# EAGLE design e18-board (EAGLE 9.6.2)
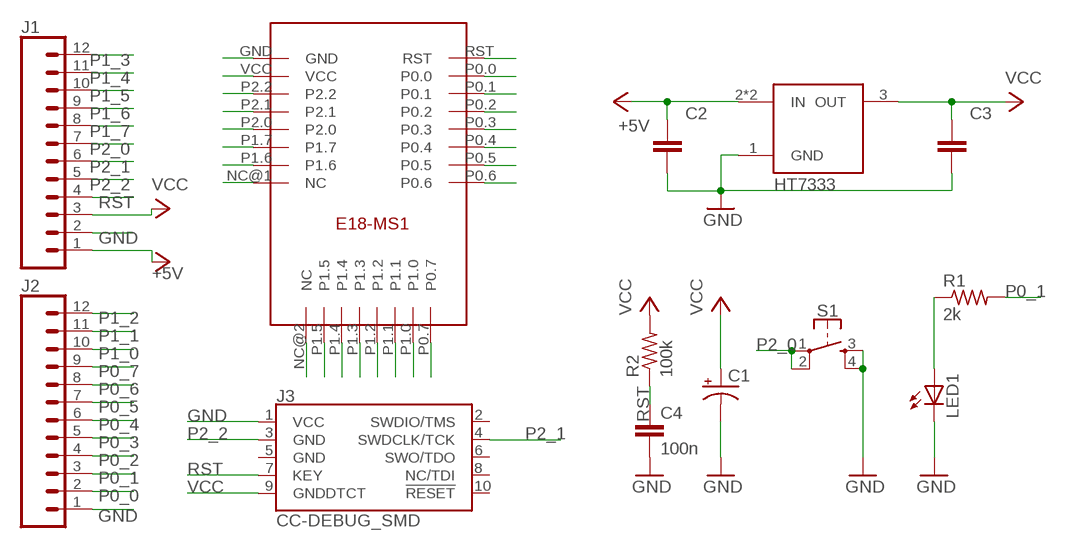
[diagram p0: schematic, sheet 1]

## Parts
C1  100uF  100UF-POLAR-EIA7343-10V-10%(TANT)  [EIA7343]
C2  C_TANTALUM-1411(3528-METRIC)  [CAPM3528X210]
C3  C_TANTALUM-1411(3528-METRIC)  [CAPM3528X210]
C4  100n  47NF-0603-25V-5%  [0603]
J1  CONN_12NO_SILK  [1X12_NO_SILK]
J2  CONN_12NO_SILK  [1X12_NO_SILK]
J3  CC-DEBUG_SMD  CORTEX_DEBUG_SMD  [SAMTECH_FTSH-105-01]
LED1  LEDCHIPLED_0805  [CHIPLED_0805]
R1  2k  R-US_R0603  [R0603]
R2  100k  R-US_R0603  [R0603]
S1  MOMENTARY-SWITCH-SPST-2-SMD-5.2MM  [TACTILE_SWITCH_SMD_5.2MM]
U$1  E18-MS1PCB  [E18-MS1-PCB]
U$2  HT7333  [SOT89]

## Nets
+5V: C2.1 J1.1 U$2.2(IN) U$2.2@1(IN)
GND: C1.C(-) C2.2 C3.2 C4.2 J1.2 J2.1 J3.1(VCC) LED1.C S1.3 S1.4 U$1.GND U$2.1(GND)
N$1: U$1.NC@2(NC)
N$2: LED1.A R1.1
N$8: U$1.NC@1(NC)
P0_0: J2.2 U$1.P0.0
P0_1: J2.3 R1.2 U$1.P0.1
P0_2: J2.4 U$1.P0.2
P0_3: J2.5 U$1.P0.3
P0_4: J2.6 U$1.P0.4
P0_5: J2.7 U$1.P0.5
P0_6: J2.8 U$1.P0.6
P0_7: J2.9 U$1.P0.7
P1_0: J2.10 U$1.P1.0
P1_1: J2.11 U$1.P1.1
P1_2: J2.12 U$1.P1.2
P1_3: J1.12 U$1.P1.3
P1_4: J1.11 U$1.P1.4
P1_5: J1.10 U$1.P1.5
P1_6: J1.9 U$1.P1.6
P1_7: J1.8 U$1.P1.7
P2_0: J1.7 S1.1 S1.2 U$1.P2.0
P2_1: J1.6 J3.4(SWDCLK/TCK) U$1.P2.1
P2_2: J1.5 J3.3(GND) U$1.P2.2
RST: C4.1 J1.4 J3.7(KEY) R2.1 U$1.RST
VCC: C1.A(+) C3.1 J1.3 J3.9(GNDDTCT) R2.2 U$1.VCC U$2.3(OUT)
Unconnected: J3.2(SWDIO/TMS) J3.5(GND) J3.6(SWO/TDO) J3.8(NC/TDI) J3.10(!RESET)

## Library data of the parts
C1 = SparkFun-Capacitors:100UF-POLAR: 100µF polarized capacitors A capacitor is a passive two-terminal electrical component used to store electrical energy temporarily in an electric field.; PROD_ID: CAP-07890
C2 C3 = Capacitor:C: Capacitor - Generic; CATEGORY: Capacitor
C4 = SparkFun-Capacitors:47NF: 47nF ceramic capacitors A capacitor is a passive two-terminal electrical component used to store electrical energy temporarily in an electric field.; PROD_ID: CAP-08605; VALUE: 47nF
J1 J2 = SparkFun-Connectors:CONN_12: Multi connection point. Often used as Generic Header-pin footprint for 0.1 inch spaced/style header connections On any of the 0.1 inch spaced packages, you can populate with these: Break Away Headers - Straight <https://www.sparkfun.com/products/116> (PRT-00116) Break Away Male Headers - Right Angle <https://www.sparkfun.com/products/553> (PRT-00553) Female Headers <https://www.sparkfun.com/products/115> (PRT-00115) Break Away Headers - Machine Pin <https://www.sparkfun.com/products/117> (PRT-00117) Break Away Female Headers - Swiss Machine Pin <https://www.sparkfun.com/products/743> (PRT-00743) For SCREWTERMINALS and SPRING TERMINALS visit here: Screw Terimnals on SparkFun.com <https://www.sparkfun.com/search/results?term=Screw+Terminals> (5mm/3.5mm/2.54mm spacing) This device is also useful as a general connection point to wire up your design to another part of your project. Our various solder wires solder well into these plated through hole pads. Hook-Up Wire - Assortment (Stranded, 22 AWG) <https://www.sparkfun.com/products/11375> (PRT-11375) Hook-Up Wire - Assortment (Solid Core, 22 AWG) <https://www.sparkfun.com/products/11367> (PRT-11367) View the entire wire category on our website here <https://www.sparkfun.com/categories/141> Special notes: Molex polarized connector foot print use with SKU : PRT-08231 with associated crimp pins and housings. 1MM SMD Version SKU: PRT-10208 NOTES ON THE VARIANTS LOCK and LOCK_LONGPADS... This footprint was designed to help hold the alignment of a through-hole component (i.e. 6-pin header) while soldering it into place. You may notice that each hole has been shifted either up or down by 0.005 of an inch from it's more standard position (which is a perfectly straight line). This slight alteration caused the pins (the squares in the middle) to touch the edges of the holes. Because they are alternating, it causes a "brace" to hold the component in place. 0.005 has proven to be the perfect amount of "off-center" position when using our standard breakaway headers. Although looks a little odd when you look at the bare footprint, once you have a header in there, the alteration is very hard to notice. Also,if you push a header all the way into place, it is covered up entirely on the bottom side.
J3 = SparkFun-Connectors:CORTEX_DEBUG: Cortex Debug Connector - 10 pin Supports JTAG debug, Serial Wire debug, and Serial Wire Viewer. PTH and SMD connector options available. General Connector Information <http://infocenter.arm.com/help/topic/com.arm.doc.faqs/attached/13634/cortex_debug_connectors.pdf> Products: PTH Connector <http://www.digikey.com/product-detail/en/cnc-tech/3220-10-0100-00/1175-1627-ND/3883661> -via Digi-Key SparkFun PSoc <https://www.sparkfun.com/products/13229> SparkFun T <https://www.sparkfun.com/products/13810>
LED1 = adafruit:LED: LED OSRAM: - CHIPLED LG R971, LG N971, LY N971, LG Q971, LY Q971, LO R971, LY R971 LH N974, LH R974 LS Q976, LO Q976, LY Q976 LO Q996 - Hyper CHIPLED LW Q18S LB Q993, LB Q99A, LB R99A - SideLED LS A670, LO A670, LY A670, LG A670, LP A670 LB A673, LV A673, LT A673, LW A673 LH A674 LY A675 LS A676, LA A676, LO A676, LY A676, LW A676 LS A679, LY A679, LG A679 - Hyper Micro SIDELED® LS Y876, LA Y876, LO Y876, LY Y876 LT Y87S - SmartLED LW L88C, LW L88S LB L89C, LB L89S, LG L890 LS L89K, LO L89K, LY L89K LS L896, LA L896, LO L896, LY L896 - TOPLED LS T670, LO T670, LY T670, LG T670, LP T670 LSG T670, LSP T670, LSY T670, LOP T670, LYG T670 LG T671, LOG T671, LSG T671 LB T673, LV T673, LT T673, LW T673 LH T674 LS T676, LA T676, LO T676, LY T676, LB T676, LH T676, LSB T676, LW T676 LB T67C, LV T67C, LT T67C, LS T67K, LO T67K, LY T67K, LW E67C LS E67B, LA E67B, LO E67B, LY E67B, LB E67C, LV E67C, LT E67C LW T67C LS T679, LY T679, LG T679 LS T770, LO T770, LY T770, LG T770, LP T770 LB T773, LV T773, LT T773, LW T773 LH T774 LS E675, LA E675, LY E675, LS T675 LS T776, LA T776, LO T776, LY T776, LB T776 LHGB T686 LT T68C, LB T68C - Hyper Mini TOPLED® LB M676 - Mini TOPLED Santana® LG M470 LS M47K, LO M47K, LY M47K Source: http://www.osram.convergy.de/
R1 R2 = adafruit3:R-US_: RESISTOR, American symbol
S1 = SparkFun-Switches:MOMENTARY-SWITCH-SPST-2: Momentary Switch (Pushbutton) - SPST - Two Circuits Normally-open (NO) SPST momentary switches (buttons, pushbuttons). Schematic symbol includes two switch circuits. Variants SMD-4.6MMX2.8MM - 4.60mm x 2.80mm Tactile Momentary Button Switch - Used on SparkFun SAMD21 Mini Breakout <https://www.sparkfun.com/products/13664> SMD-5.2MM - Mini Pushbutton Switch - SMD <https://www.sparkfun.com/products/8720> - Used on Arduino Pro Mini <https://www.sparkfun.com/products/11114>; PROD_ID: SWCH-08247; SF_SKU: COM-08720
U$1 = e18-ms1-ipx-pcb:E18-MS1
U$2 = HT7333_SOT89:HT7333

## Board
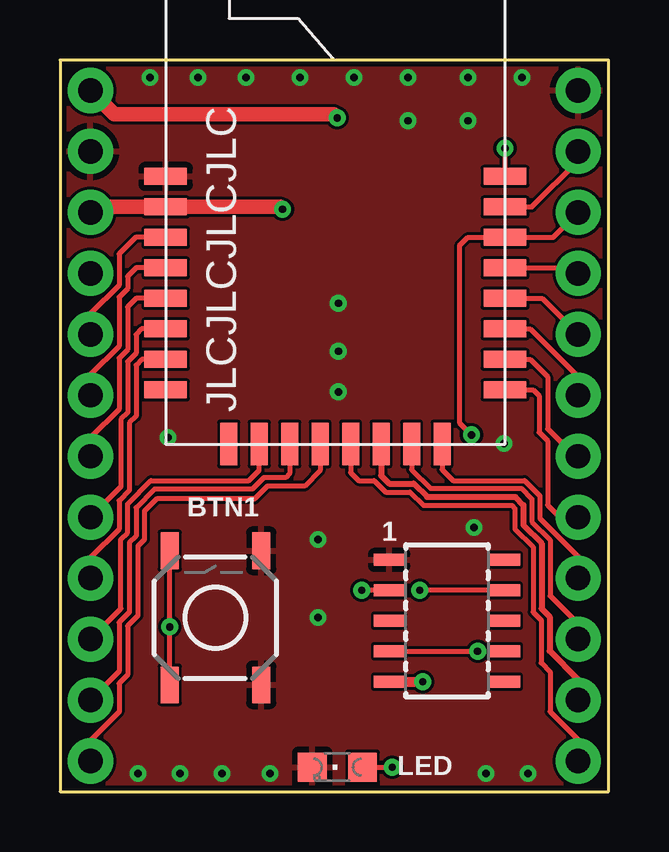
[diagram p1: board, top side]
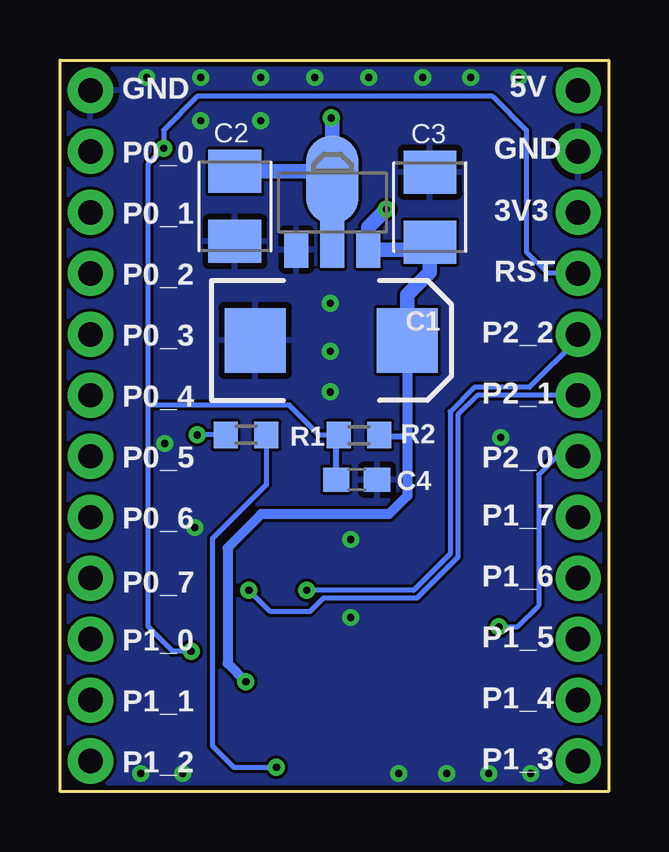
[diagram p2: board, bottom side, seen from below]

Size 22.86 x 30.48 mm. Coordinates in mm from the lower left corner, seen from the top.
Outline: 0,0 22.86,0 22.86,30.48 0,30.48 0,0
Copper layers (1*16): Top 0.035mm / dielectric 1.5mm / Bottom 0.035mm
Design rules "default *": minimum track width 0.2mm, minimum drill 0.3mm, track to track 5mil, track to pad 5mil, pad to pad 6mil, via to via 6mil, smd to smd 5mil, copper to edge 0.2mm, drill to drill 0.3mm, minimum pad ring 10mil, minimum via ring 8mil, stop-mask expansion 4mil, vias tented up to drill 0.3mm, thermal gap 10mil

### Footprints (pad centres in the part's own frame; a part is rotated, then mirrored left to right if it is on the bottom)
EIA7343 = smd 2.55 x 2.7: A 3.17,0; C -3.17,0
CAPM3528X210 = smd 1.796 x 2.204: 1 -1.46,0; 2 1.46,0
0603 = smd 1.1 x 1: 1 -0.85,0; 2 0.85,0
1X12_NO_SILK = drill 1.016 pad 1.88: 1 0,0; 2 2.54,0; 3 5.08,0; 4 7.62,0; 5 10.16,0; 6 12.7,0; 7 15.24,0; 8 17.78,0; 9 20.32,0; 10 22.86,0; 11 25.4,0; 12 27.94,0
SAMTECH_FTSH-105-01 = smd 0.508 x 1.27: 1 -2.54,-2.413; 2 -2.54,2.413; 3 -1.27,-2.413; 4 -1.27,2.413; 5 0,-2.413; 6 0,2.413; 7 1.27,-2.413; 8 1.27,2.413; 9 2.54,-2.413; 10 2.54,2.413
CHIPLED_0805 = smd 1.2 x 1.2: A 0,-1.05; C 0,1.05
R0603 = smd 1 x 1.1: 1 -0.85,0; 2 0.85,0
TACTILE_SWITCH_SMD_5.2MM = smd 1.524 x 0.762: 1 -2.794,1.905; 2 2.794,1.905; 3 -2.794,-1.905; 4 2.794,-1.905
E18-MS1-PCB = smd 0.711 x 1.778: GND 11.15,14.14; NC@1 2.26,14.14; P0.0 9.88,0; P0.1 8.61,0; P0.2 7.34,0; P0.3 6.07,0; P0.4 4.8,0; P0.5 3.53,0; P0.6 2.26,0; P1.6 3.53,14.14; P1.7 4.8,14.14; P2.0 6.07,14.14; P2.1 7.34,14.14; P2.2 8.61,14.14; RST 11.15,0; VCC 9.88,14.14 | smd 1.778 x 0.711: NC@2 0,11.51; P0.7 0,2.62; P1.0 0,3.89; P1.1 0,5.16; P1.2 0,6.43; P1.3 0,7.7; P1.4 0,8.97; P1.5 0,10.24
SOT89 = smd 1 x 1.5: 1 -1.499,-1.981; 3 1.499,-1.981 | smd 1 x 2: 2 0,-1.727 | smd 2.2 x 3.7: 2@1 0,0.94

### Placement (x,y rotation side)
C1  11.56,18.8 0 bottom
C2  15.57,24.38 270 bottom
C3  7.44,24.35 90 bottom
C4  10.5,13 0 bottom
J1  1.27,29.21 270 top
J2  21.59,29.21 270 top
J3  16.13,7.11 270 top
LED1  11.56,1.02 90 top
R1  15.11,14.86 180 bottom
R2  10.4,14.85 0 bottom
S1  6.48,7.24 90 top
U$1  18.54,14.48 90 top
U$2  11.51,24.56 0 bottom

### Tracks (layer width: path | path; a pad name or v marks a point on that pad's centre or on a via)
+5V  (via drill 0.3)
  Top 0.61: J1.1 2.27,28.21 11.41,28.21 v11.56,28.07
  Bottom 0.2: U$2.2 11.51,26.42
  Bottom 0.61: C2.1 11.85,25.84 U$2.2@1 11.51,26.42 11.51,28.02 v11.56,28.07
GND  (via drill 0.3)
  other vias: 3.25,0.75 5,0.75 6.75,0.75 8.75,0.75 19.5,0.75 17.75,0.75 10.75,10.5 10.75,7.25 3.75,29.75 5.75,29.75 7.75,29.75 10,29.75 12.25,29.75 14.5,29.75 17,29.75 19.25,29.75 4.5,14.75 18.5,14.5 17.25,11 11.6,20.35 11.6,18.35 11.6,16.65 14.5,27.95 17,27.95
  pour Top: -0.64,30.61 23.37,30.61 23.37,-0.25 -0.64,-0.25
  pour Bottom: -0.38,30.86 23.11,30.86 23.11,0 -0.38,0
N$2  (via drill 0.3)
  Top 0.2: LED1.A v13.84,1.02
  Bottom 0.2: R1.1 14.26,12.79 16.51,10.54 16.51,1.91 15.62,1.02 v13.84,1.02
P0_0
  Top 0.2: U$1.P0.0 19.66,24.36 21.59,26.29 J2.2
P0_1  (via drill 0.3)
  Top 0.2: J2.3 20.55,23.09 U$1.P0.1 16.99,23.09 16.64,22.73 16.64,15.37 v17.14,14.86
  Bottom 0.2: R1.2 v17.14,14.86
P0_2
  Top 0.2: U$1.P0.2 21.36,21.82 J2.4
P0_3
  Top 0.2: U$1.P0.3 20.09,20.55 J2.5
P0_4
  Top 0.2: U$1.P0.4 19.58,19.28 21.59,17.27 J2.6
P0_5
  Top 0.2: U$1.P0.5 19.58,18.01 20.32,17.27 20.32,15.11 21.46,13.97 J2.7
P0_6
  Top 0.2: U$1.P0.6 19.71,16.74 19.97,16.48 19.97,14.97 20.32,14.62 20.32,11.94 20.83,11.43 J2.8
P0_7
  Top 0.2: U$1.P0.7 15.92,13.41 16.38,12.95 19.36,12.95 19.99,12.32 19.99,11.38 21.59,9.78 J2.9
P1_0
  Top 0.2: U$1.P1.0 14.65,13.41 15.44,12.63 19.22,12.63 19.67,12.18 19.67,11.24 20.42,10.48 20.42,8.15 21.59,6.99 J2.10
P1_1
  Top 0.254: U$1.P1.1 13.38,13.16 13.72,12.83 14.74,12.83 15.29,12.27 18.98,12.27 19.31,11.94 19.31,11.1 20.07,10.34 20.07,7.62 20.4,7.29 20.4,5.86 21.59,4.66 J2.11
P1_2
  Top 0.2: U$1.P1.2 12.11,13.29 12.45,12.95 13.09,12.95 13.57,12.47 14.59,12.47 15.15,11.92 18.83,11.92 18.96,11.79 18.96,10.95 19.71,10.19 19.71,7.47 20.04,7.14 20.04,5.36 20.42,4.98 20.42,3.33 21.59,2.16 J2.12
P1_3
  Top 0.2: U$1.P1.3 10.84,13.38 10.19,12.73 8.64,12.73 8.11,12.19 4.03,12.19 3.52,11.69 3.52,10.5 3.25,10.22 3.25,7.33 2.81,6.9 2.81,4.86 2.46,4.5 2.46,3.32 1.27,2.12 J1.12
P1_4
  Top 0.2: U$1.P1.4 9.57,13.26 9.4,13.08 8.5,13.08 8.02,12.6 3.94,12.6 3.17,11.83 3.17,10.64 2.89,10.37 2.89,7.47 2.46,7.04 2.46,5 J1.11
P1_5
  Top 0.2: J1.10 2.54,7.62 2.54,10.52 2.81,10.79 2.81,11.98 3.79,12.95 7.87,12.95 8.3,13.38 U$1.P1.5
P1_6
  Top 0.2: U$1.P1.6 3.41,18.01 3.17,17.77 3.17,15.63 2.89,15.36 2.89,12.55 2.46,12.12 2.46,10.94 1.27,9.74 J1.9
P1_7
  Top 0.2: U$1.P1.7 3.4,19.28 3.17,19.05 3.17,18.26 2.81,17.91 2.81,15.78 2.54,15.5 2.54,12.7 J1.8
P2_0  (via drill 0.3)
  Top 0.2: U$1.P2.0 3.17,20.55 2.81,20.19 2.81,18.41 2.46,18.06 2.46,15.92 1.27,14.73 J1.7 | S1.1 v4.57,6.86 S1.2
  Bottom 0.2: J1.7 2.16,13.97 2.92,13.21 2.92,7.75 3.81,6.86 v4.57,6.86
P2_1  (via drill 0.3)
  Top 0.2: U$1.P2.1 3.17,21.82 2.81,21.46 2.81,20.95 2.46,20.6 2.46,18.56 1.27,17.36 J1.6 | J3.4 v14.99,8.38
  Bottom 0.2: J1.6 5.46,16.51 6.28,15.69 6.28,9.77 7.99,8.05 11.88,8.05 12.45,7.49 14.1,7.49 v14.99,8.38
P2_2  (via drill 0.3)
  Top 0.2: U$1.P2.2 3.15,23.09 2.46,22.4 2.46,21.1 1.27,19.9 J1.5 | J3.3 v12.57,8.38
  Bottom 0.2: J1.5 1.27,18.87 3.3,16.84 5.6,16.84 6.6,15.83 6.6,9.91 8.13,8.38 v12.57,8.38
RST  (via drill 0.3)
  Top 0.2: U$1.RST v18.54,26.8 | J3.7 v17.4,5.84
  Bottom 0.2: J1.4 2.54,21.59 3.43,22.48 3.43,27.56 4.83,28.96 17.14,28.96 18.54,27.56 v18.54,26.8 19.18,26.16 19.18,16.1 | v17.4,5.84 18.16,5.84 19.18,6.86 19.18,16.1 | R2.1 12.05,14.85 13.3,16.1 19.18,16.1
  Bottom 0.254: C4.1 11.35,14.75 R2.1
VCC  (via drill 0.3)
  Top 0.406: J3.9 v15.11,4.57
  Top 0.61: v9.27,24.26 9.17,24.36 U$1.VCC 1.5,24.36 J1.3
  Bottom 0.254: R2.2 9.5,14.8 8.39,14.8
  Bottom 0.406: C1.A 8.39,14.8 8.39,12.32 9.15,11.56 14.48,11.56 15.88,10.15 15.88,5.34 v15.11,4.57
  Bottom 0.508: 7.44,21.97 C3.1 7.76,22.57
  Bottom 0.61: 7.76,22.57 U$2.3 10.01,23.52 v9.27,24.26 | C1.A 8.39,20.7 7.44,21.64 7.44,21.97

### Text on the board
tNames: JLCJLCJLCJLC | BTN1 | 1 | LED
bNames: 5V | GND | GND | P0_0 | 3V3 | P0_1 | RST | P0_2 | P2_2 | C1 | P0_3 | P2_1 | P0_4 | R2 | R1 | P2_0 | P0_5 | P1_7 | P0_6 | P1_6 | P0_7 | P1_5 | P1_0 | P1_4 | P1_1 | P1_3 | P1_2